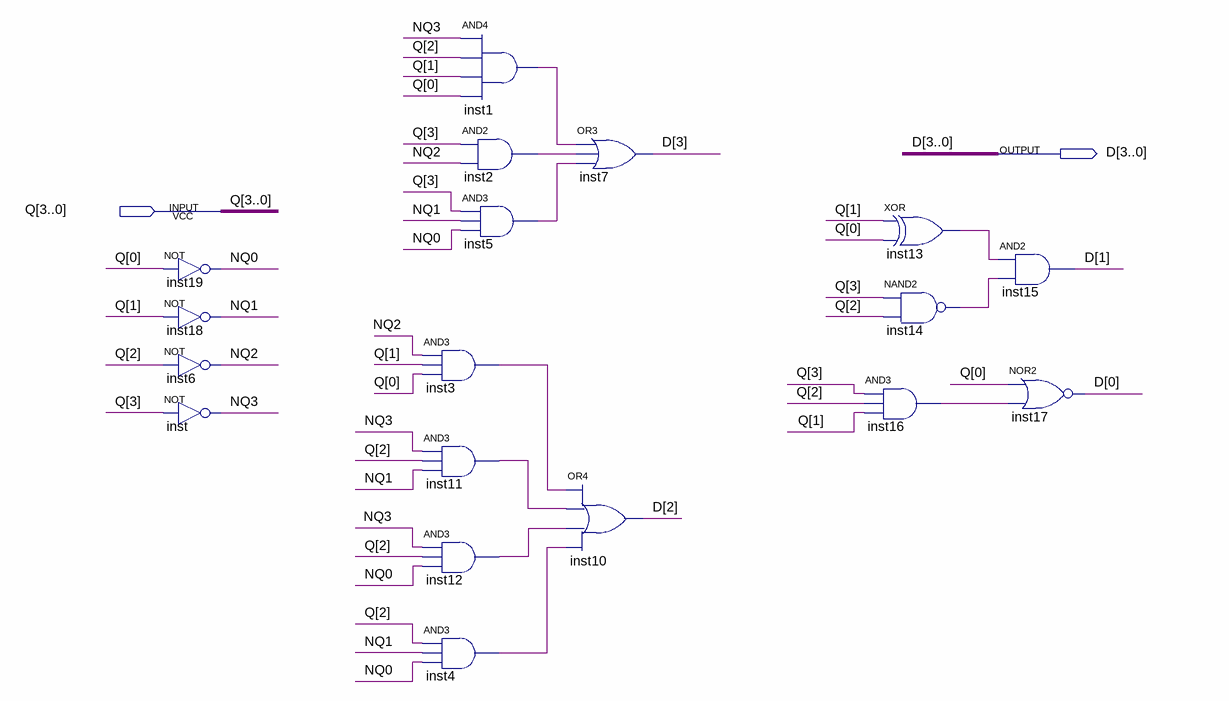
[diagram p0: schematic sheet]
// Quartus schematic NextState.bdf as structural Verilog: 18 symbols, 2 pins
module NextState (
  input  [3:0] Q,
  output [3:0] D
);

  wire inst1_out, inst2_out, inst3_out, inst4_out, inst5_out, inst11_out, inst12_out, inst13_out, inst14_out,
       inst16_out, NQ0, NQ1, NQ2, NQ3;

  not inst19 (NQ0, Q[0]);
  not inst18 (NQ1, Q[1]);
  not inst6 (NQ2, Q[2]);
  not inst (NQ3, Q[3]);
  and inst1 (inst1_out, NQ3, Q[2], Q[1], Q[0]);
  and inst2 (inst2_out, Q[3], NQ2);
  and inst5 (inst5_out, Q[3], NQ1, NQ0);
  and inst3 (inst3_out, NQ2, Q[1], Q[0]);
  and inst11 (inst11_out, NQ3, Q[2], NQ1);
  and inst12 (inst12_out, NQ3, Q[2], NQ0);
  and inst4 (inst4_out, Q[2], NQ1, NQ0);
  or inst7 (D[3], inst1_out, inst2_out, inst5_out);
  or inst10 (D[2], inst3_out, inst11_out, inst12_out, inst4_out);
  and inst16 (inst16_out, Q[3], Q[2], Q[1]);
  xor inst13 (inst13_out, Q[1], Q[0]);
  nand inst14 (inst14_out, Q[3], Q[2]);
  and inst15 (D[1], inst13_out, inst14_out);
  nor inst17 (D[0], Q[0], inst16_out);
endmodule
